# Altium schematic sheet S07.SchDoc: IEEE-1394/Ethernet FPGA Controller
size 381 x 254 mm; Revision: 3.2; SheetNumber: 7; SheetTotal: 10
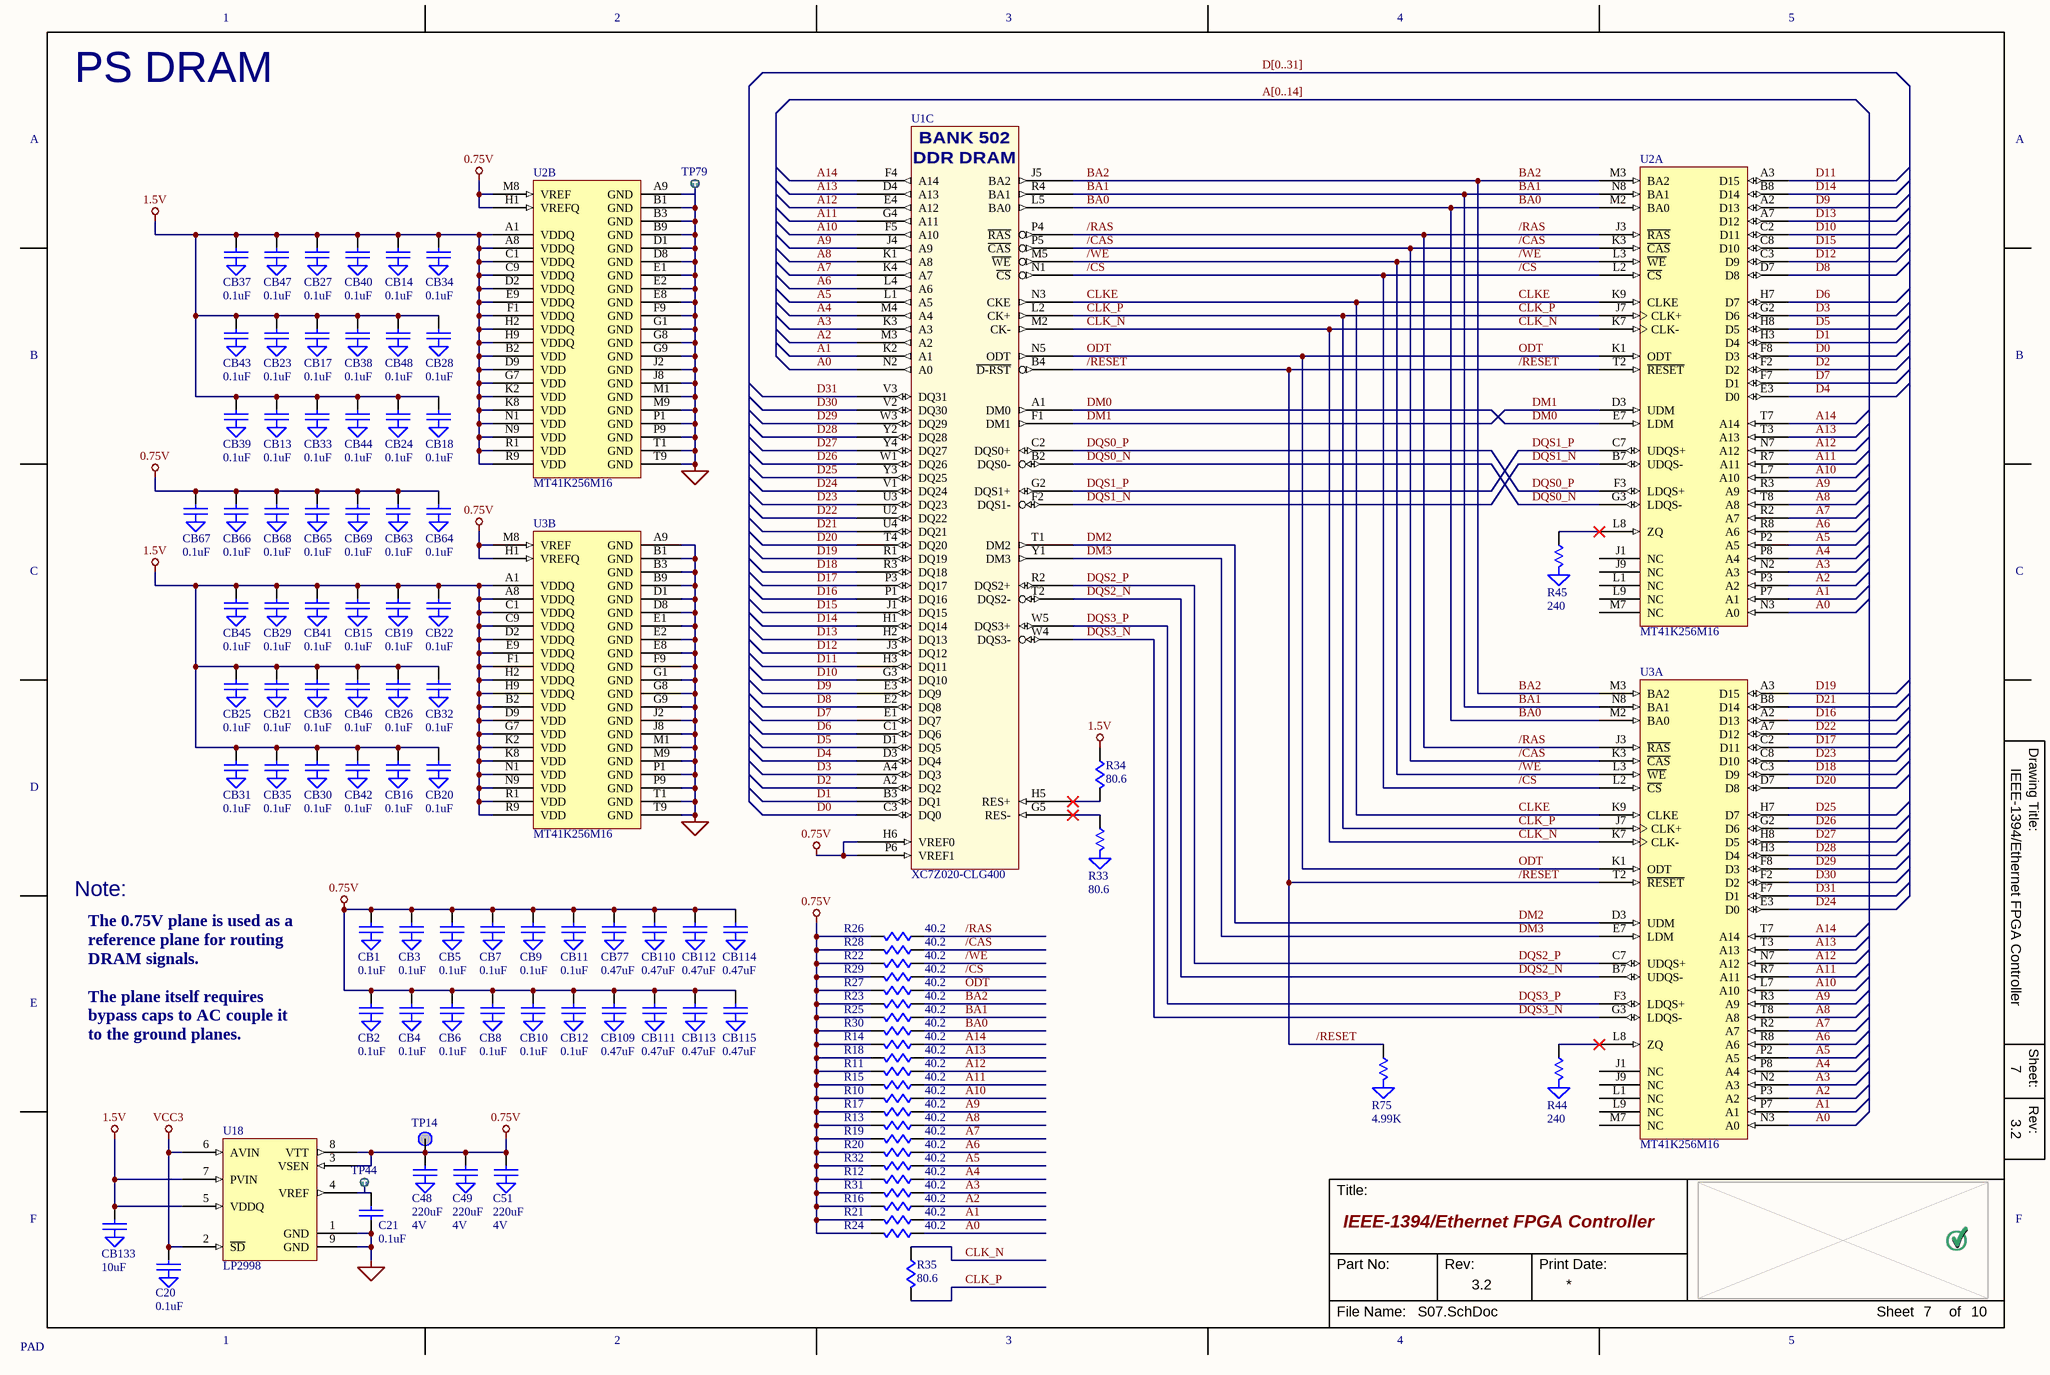
[diagram p0: S07.SchDoc]

## Parts
C20  0.1uF  [C0402]
C21  0.1uF  [C0402]
C48  220uF  [C1206]
C49  220uF  [C1206]
C51  220uF  [C1206]
CB1  0.1uF  [C0201]
CB2  0.1uF  [C0201]
CB3  0.1uF  [C0201]
CB4  0.1uF  [C0201]
CB5  0.1uF  [C0201]
CB6  0.1uF  [C0201]
CB7  0.1uF  [C0201]
CB8  0.1uF  [C0201]
CB9  0.1uF  [C0201]
CB10  0.1uF  [C0201]
CB11  0.1uF  [C0201]
CB12  0.1uF  [C0201]
CB13  0.1uF  [C0201]
CB14  0.1uF  [C0201]
CB15  0.1uF  [C0201]
CB16  0.1uF  [C0201]
CB17  0.1uF  [C0201]
CB18  0.1uF  [C0201]
CB19  0.1uF  [C0201]
CB20  0.1uF  [C0201]
CB21  0.1uF  [C0201]
CB22  0.1uF  [C0201]
CB23  0.1uF  [C0201]
CB24  0.1uF  [C0201]
CB25  0.1uF  [C0201]
CB26  0.1uF  [C0201]
CB27  0.1uF  [C0201]
CB28  0.1uF  [C0201]
CB29  0.1uF  [C0201]
CB30  0.1uF  [C0201]
CB31  0.1uF  [C0201]
CB32  0.1uF  [C0201]
CB33  0.1uF  [C0201]
CB34  0.1uF  [C0201]
CB35  0.1uF  [C0201]
CB36  0.1uF  [C0201]
CB37  0.1uF  [C0201]
CB38  0.1uF  [C0201]
CB39  0.1uF  [C0201]
CB40  0.1uF  [C0201]
CB41  0.1uF  [C0201]
CB42  0.1uF  [C0201]
CB43  0.1uF  [C0201]
CB44  0.1uF  [C0201]
CB45  0.1uF  [C0201]
CB46  0.1uF  [C0201]
CB47  0.1uF  [C0201]
CB48  0.1uF  [C0201]
CB63  0.1uF  [C0201]
CB64  0.1uF  [C0201]
CB65  0.1uF  [C0201]
CB66  0.1uF  [C0201]
CB67  0.1uF  [C0201]
CB68  0.1uF  [C0201]
CB69  0.1uF  [C0201]
CB77  0.47uF  [CB0402]
CB109  0.47uF  [CB0402]
CB110  0.47uF  [CB0402]
CB111  0.47uF  [CB0402]
CB112  0.47uF  [CB0402]
CB113  0.47uF  [CB0402]
CB114  0.47uF  [CB0402]
CB115  0.47uF  [CB0402]
CB133  10uF  [CB0603]
R10  40.2  [R0402]
R11  40.2  [R0402]
R12  40.2  [R0402]
R13  40.2  [R0402]
R14  40.2  [R0402]
R15  40.2  [R0402]
R16  40.2  [R0402]
R17  40.2  [R0402]
R18  40.2  [R0402]
R19  40.2  [R0402]
R20  40.2  [R0402]
R21  40.2  [R0402]
R22  40.2  [R0402]
R23  40.2  [R0402]
R24  40.2  [R0402]
R25  40.2  [R0402]
R26  40.2  [R0402]
R27  40.2  [R0402]
R28  40.2  [R0402]
R29  40.2  [R0402]
R30  40.2  [R0402]
R31  40.2  [R0402]
R32  40.2  [R0402]
R33  80.6  [R0402]
R34  80.6  [R0402]
R35  80.6  [R0402]
R44  240  [R0402]
R45  240  [R0402]
R75  4.99K  [R0402]
TP14  PAD  [PAD25-SM]  (value not drawn)  (no BOM)
TP44  Footprint: PAD  (hidden comment: NOLBL_C21_1_1)  (no BOM)
TP79  Footprint: PAD  (hidden comment: GND)  (no BOM)
U1  XC7Z020-CLG400  [BGA-400-08mm]  (part C of 9)
U2  MT41K256M16  [BGA-96-14x8mm]  (parts A,B of 2)
U3  MT41K256M16  [BGA-96-14x8mm]  (parts A,B of 2)
U18  LP2998  [SO-9]

## Nets
0.75V: C48.1 C49.1 C51.1 CB1.1 CB2.1 CB3.1 CB4.1 CB5.1 CB6.1 CB7.1 CB8.1 CB9.1 CB10.1 CB11.1 CB12.1 CB63.1 CB64.1 CB65.1 CB66.1 CB67.1 CB68.1 CB69.1 CB77.1 CB109.1 CB110.1 CB111.1 CB112.1 CB113.1 CB114.1 CB115.1 R10.2 R11.2 R12.2 R13.2 R14.2 R15.2 R16.2 R17.2 R18.2 R19.2 R20.2 R21.2 R22.2 R23.2 R24.2 R25.2 R26.2 R27.2 R28.2 R29.2 R30.2 R31.2 R32.2 TP14.1 U1.H6(VREF0) U1.P6(VREF1) U2.H1(VREFQ) U2.M8(VREF) U3.H1(VREFQ) U3.M8(VREF) U18.3(VSEN) U18.8(VTT)
1.5V: CB13.1 CB14.1 CB15.1 CB16.1 CB17.1 CB18.1 CB19.1 CB20.1 CB21.1 CB22.1 CB23.1 CB24.1 CB25.1 CB26.1 CB27.1 CB28.1 CB29.1 CB30.1 CB31.1 CB32.1 CB33.1 CB34.1 CB35.1 CB36.1 CB37.1 CB38.1 CB39.1 CB40.1 CB41.1 CB42.1 CB43.1 CB44.1 CB45.1 CB46.1 CB47.1 CB48.1 CB133.1 R34.1 U2.A1(VDDQ) U2.A8(VDDQ) U2.B2(VDD) U2.C1(VDDQ) U2.C9(VDDQ) U2.D2(VDDQ) U2.D9(VDD) U2.E9(VDDQ) U2.F1(VDDQ) U2.G7(VDD) U2.H2(VDDQ) U2.H9(VDDQ) U2.K2(VDD) U2.K8(VDD) U2.N1(VDD) U2.N9(VDD) U2.R1(VDD) U2.R9(VDD) U3.A1(VDDQ) U3.A8(VDDQ) U3.B2(VDD) U3.C1(VDDQ) U3.C9(VDDQ) U3.D2(VDDQ) U3.D9(VDD) U3.E9(VDDQ) U3.F1(VDDQ) U3.G7(VDD) U3.H2(VDDQ) U3.H9(VDDQ) U3.K2(VDD) U3.K8(VDD) U3.N1(VDD) U3.N9(VDD) U3.R1(VDD) U3.R9(VDD) U18.5(VDDQ) U18.7(PVIN)
GND: C20.2(GND) C21.2 C48.2(GND) C49.2(GND) C51.2(GND) CB1.2(GND) CB2.2(GND) CB3.2(GND) CB4.2(GND) CB5.2(GND) CB6.2(GND) CB7.2(GND) CB8.2(GND) CB9.2(GND) CB10.2(GND) CB11.2(GND) CB12.2(GND) CB13.2(GND) CB14.2(GND) CB15.2(GND) CB16.2(GND) CB17.2(GND) CB18.2(GND) CB19.2(GND) CB20.2(GND) CB21.2(GND) CB22.2(GND) CB23.2(GND) CB24.2(GND) CB25.2(GND) CB26.2(GND) CB27.2(GND) CB28.2(GND) CB29.2(GND) CB30.2(GND) CB31.2(GND) CB32.2(GND) CB33.2(GND) CB34.2(GND) CB35.2(GND) CB36.2(GND) CB37.2(GND) CB38.2(GND) CB39.2(GND) CB40.2(GND) CB41.2(GND) CB42.2(GND) CB43.2(GND) CB44.2(GND) CB45.2(GND) CB46.2(GND) CB47.2(GND) CB48.2(GND) CB63.2(GND) CB64.2(GND) CB65.2(GND) CB66.2(GND) CB67.2(GND) CB68.2(GND) CB69.2(GND) CB77.2(GND) CB109.2(GND) CB110.2(GND) CB111.2(GND) CB112.2(GND) CB113.2(GND) CB114.2(GND) CB115.2(GND) CB133.2(GND) R33.2(GND) R44.2(GND) R45.2(GND) R75.2(GND) TP79.1 U2.A9(GND) U2.B1(GND) U2.B3(GND) U2.B9(GND) U2.D1(GND) U2.D8(GND) U2.E1(GND) U2.E2(GND) U2.E8(GND) U2.F9(GND) U2.G1(GND) U2.G8(GND) U2.G9(GND) U2.J2(GND) U2.J8(GND) U2.M1(GND) U2.M9(GND) U2.P1(GND) U2.P9(GND) U2.T1(GND) U2.T9(GND) U3.A9(GND) U3.B1(GND) U3.B3(GND) U3.B9(GND) U3.D1(GND) U3.D8(GND) U3.E1(GND) U3.E2(GND) U3.E8(GND) U3.F9(GND) U3.G1(GND) U3.G8(GND) U3.G9(GND) U3.J2(GND) U3.J8(GND) U3.M1(GND) U3.M9(GND) U3.P1(GND) U3.P9(GND) U3.T1(GND) U3.T9(GND) U18.1(GND) U18.9(GND)
VCC3: C20.1 U18.2(~{SD}) U18.6(AVIN)
/CAS: R28.1 U1.P5(~{CAS}) U2.K3(~{CAS}) U3.K3(~{CAS})
/CS: R29.1 U1.N1(~{CS}) U2.L2(~{CS}) U3.L2(~{CS})
/RAS: R26.1 U1.P4(~{RAS}) U2.J3(~{RAS}) U3.J3(~{RAS})
/RESET: R75.1 U1.B4(~{D-RST}) U2.T2(~{RESET}) U3.T2(~{RESET})
/WE: R22.1 U1.M5(~{WE}) U2.L3(~{WE}) U3.L3(~{WE})
A0: R24.1 U1.N2(A0) U2.N3(A0) U3.N3(A0)
A1: R21.1 U1.K2(A1) U2.P7(A1) U3.P7(A1)
A2: R16.1 U1.M3(A2) U2.P3(A2) U3.P3(A2)
A3: R31.1 U1.K3(A3) U2.N2(A3) U3.N2(A3)
A4: R12.1 U1.M4(A4) U2.P8(A4) U3.P8(A4)
A5: R32.1 U1.L1(A5) U2.P2(A5) U3.P2(A5)
A6: R20.1 U1.L4(A6) U2.R8(A6) U3.R8(A6)
A7: R19.1 U1.K4(A7) U2.R2(A7) U3.R2(A7)
A8: R13.1 U1.K1(A8) U2.T8(A8) U3.T8(A8)
A9: R17.1 U1.J4(A9) U2.R3(A9) U3.R3(A9)
A10: R10.1 U1.F5(A10) U2.L7(A10) U3.L7(A10)
A11: R15.1 U1.G4(A11) U2.R7(A11) U3.R7(A11)
A12: R11.1 U1.E4(A12) U2.N7(A12) U3.N7(A12)
A13: R18.1 U1.D4(A13) U2.T3(A13) U3.T3(A13)
A14: R14.1 U1.F4(A14) U2.T7(A14) U3.T7(A14)
BA0: R30.1 U1.L5(BA0) U2.M2(BA0) U3.M2(BA0)
BA1: R25.1 U1.R4(BA1) U2.N8(BA1) U3.N8(BA1)
BA2: R23.1 U1.J5(BA2) U2.M3(BA2) U3.M3(BA2)
CLK_N: R35.1 U1.M2(CK-) U2.K7(CLK-) U3.K7(CLK-)
CLK_P: R35.2 U1.L2(CK+) U2.J7(CLK+) U3.J7(CLK+)
CLKE: U1.N3(CKE) U2.K9(CLKE) U3.K9(CLKE)
D0: U1.C3(DQ0) U2.F8(D3)
D1: U1.B3(DQ1) U2.H3(D4)
D2: U1.A2(DQ2) U2.F2(D2)
D3: U1.A4(DQ3) U2.G2(D6)
D4: U1.D3(DQ4) U2.E3(D0)
D5: U1.D1(DQ5) U2.H8(D5)
D6: U1.C1(DQ6) U2.H7(D7)
D7: U1.E1(DQ7) U2.F7(D1)
D8: U1.E2(DQ8) U2.D7(D8)
D9: U1.E3(DQ9) U2.A2(D13)
D10: U1.G3(DQ10) U2.C2(D11)
D11: U1.H3(DQ11) U2.A3(D15)
D12: U1.J3(DQ12) U2.C3(D9)
D13: U1.H2(DQ13) U2.A7(D12)
D14: U1.H1(DQ14) U2.B8(D14)
D15: U1.J1(DQ15) U2.C8(D10)
D16: U1.P1(DQ16) U3.A2(D13)
D17: U1.P3(DQ17) U3.C2(D11)
D18: U1.R3(DQ18) U3.C3(D9)
D19: U1.R1(DQ19) U3.A3(D15)
D20: U1.T4(DQ20) U3.D7(D8)
D21: U1.U4(DQ21) U3.B8(D14)
D22: U1.U2(DQ22) U3.A7(D12)
D23: U1.U3(DQ23) U3.C8(D10)
D24: U1.V1(DQ24) U3.E3(D0)
D25: U1.Y3(DQ25) U3.H7(D7)
D26: U1.W1(DQ26) U3.G2(D6)
D27: U1.Y4(DQ27) U3.H8(D5)
D28: U1.Y2(DQ28) U3.H3(D4)
D29: U1.W3(DQ29) U3.F8(D3)
D30: U1.V2(DQ30) U3.F2(D2)
D31: U1.V3(DQ31) U3.F7(D1)
DM0: U1.A1(DM0) U2.E7(LDM)
DM1: U1.F1(DM1) U2.D3(UDM)
DM2: U1.T1(DM2) U3.D3(UDM)
DM3: U1.Y1(DM3) U3.E7(LDM)
DQS0_N: U1.B2(DQS0-) U2.G3(LDQS-)
DQS0_P: U1.C2(DQS0+) U2.F3(LDQS+)
DQS1_N: U1.F2(DQS1-) U2.B7(UDQS-)
DQS1_P: U1.G2(DQS1+) U2.C7(UDQS+)
DQS2_N: U1.T2(DQS2-) U3.B7(UDQS-)
DQS2_P: U1.R2(DQS2+) U3.C7(UDQS+)
DQS3_N: U1.W4(DQS3-) U3.G3(LDQS-)
DQS3_P: U1.W5(DQS3+) U3.F3(LDQS+)
ODT: R27.1 U1.N5(ODT) U2.K1(ODT) U3.K1(ODT)
NetC21_1: C21.1 TP44.1 U18.4(VREF)
NetR33_1: R33.1 U1.G5(RES-)
NetR34_2: R34.2 U1.H5(RES+)
NetR44_1: R44.1 U3.L8(ZQ)
NetR45_1: R45.1 U2.L8(ZQ)

Not connected (* = marked no-connect by the designer): U2 J1(NC) J9(NC) L1(NC) L9(NC) M7(NC); U3 J1(NC) J9(NC) L1(NC) L9(NC) M7(NC)

## Buses and harness runs
bus A[0..14]
bus D[0..31]

## Notes on the sheet
- PS DRAM
- Note:
- The 0.75V plane is used as a reference plane for routing DRAM signals.
  The plane itself requires bypass caps to AC couple it to the ground planes.
- 1
- 2
- 3
- 4
- 5
- A
- B
- C
- Drawing Title:
- D
- E
- Sheet:
- Rev:
- F
- Title:
- Part No:
- Print Date:
- File Name:
- Sheet
- of
- (in symbol CAP-GND) 4V
- (in symbol XC7Z020-CLG400, part C) BANK 502; DDR DRAM

## Library data of the parts
C20 C48 C49 C51 CB1-CB48 CB63-CB69 CB77 CB109-CB115 CB133 = CAP-GND
C21 = CAP
R10-R32 R34 R35 = R
R33 R44 R45 R75 = R-GND
TP44 TP79 = Tomachie_TP_North: Test Point